# Altium schematic sheet 4. Buck Boost_12V.SchDoc
size A4; SheetNumber: 4; SheetTotal: 6
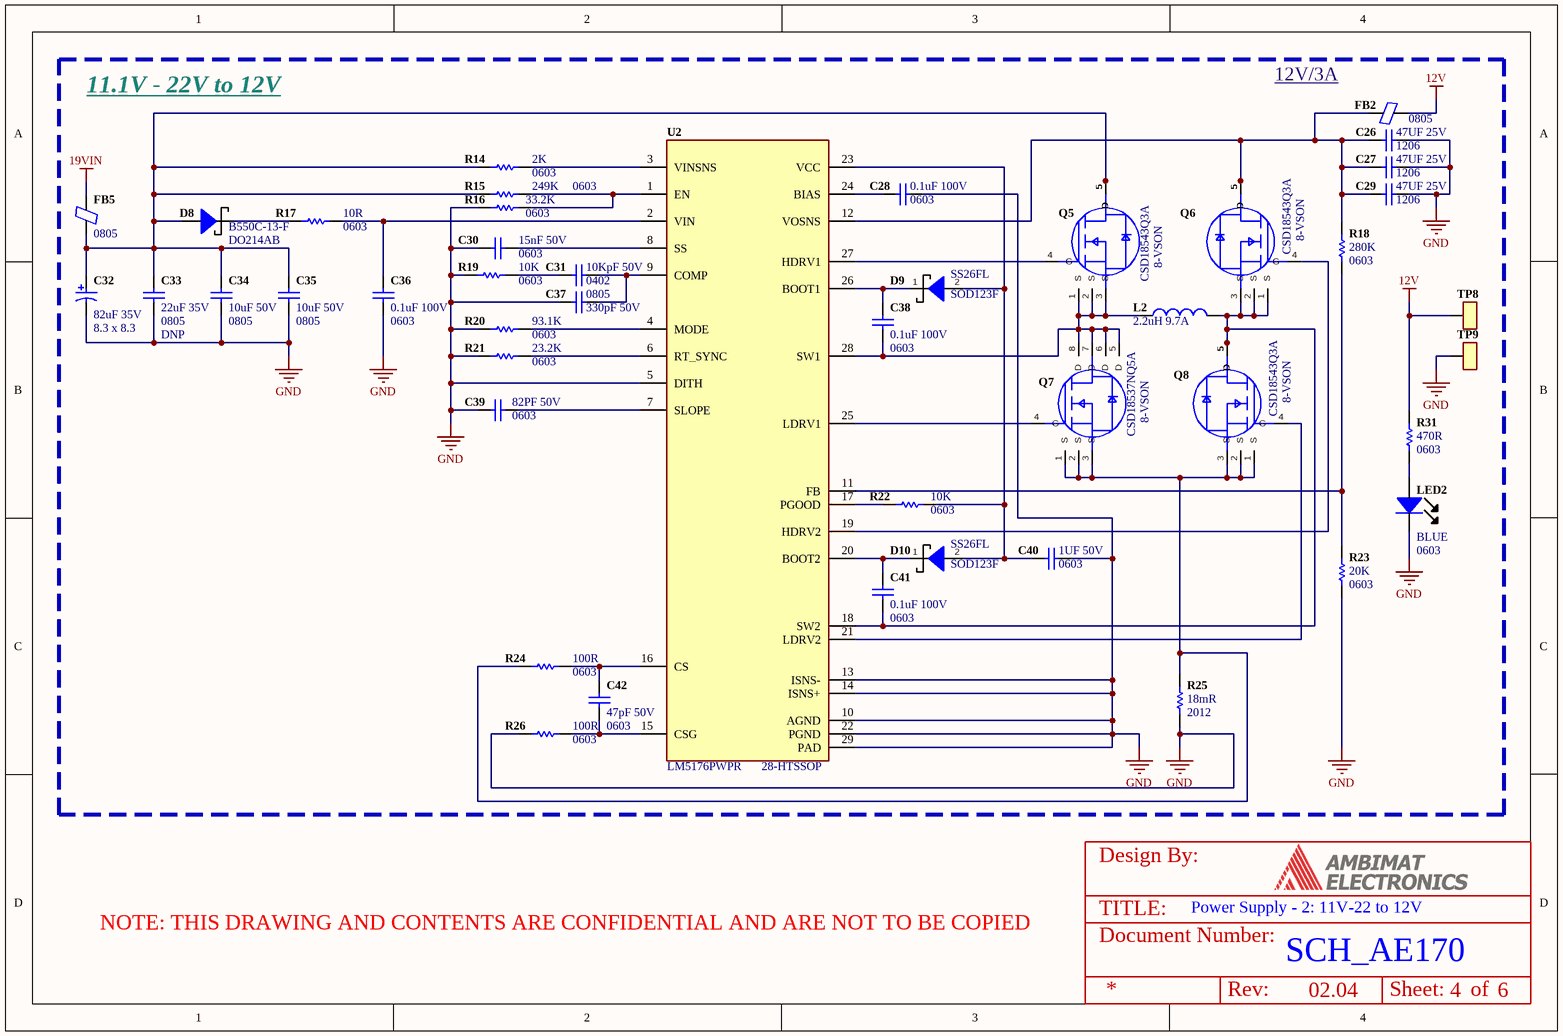
[diagram p0: 4. Buck Boost_12V.SchDoc]

## Parts
C26  Part Name: 47UF 25V  PCB Footprint: 1206  [1206 - NP]  (hidden comment: CAP CER 47UF 25V X5R 1206)
C27  Part Name: 47UF 25V  PCB Footprint: 1206  [1206 - NP]  (hidden comment: CAP CER 47UF 25V X5R 1206)
C28  Part Name: 0.1uF 100V  PCB Footprint: 0603  [0603C]  (hidden comment: CAP CER 0.1UF 100V X7R 0603)
C29  Part Name: 47UF 25V  PCB Footprint: 1206  [1206 - NP]  (hidden comment: CAP CER 47UF 25V X5R 1206)
C30  Part Name: 15nF 50V  PCB Footprint: 0603  [0603C]  (hidden comment: CAP CER 0.015UF 50V X7R 0603)
C31  Part Name: 10KpF 50V  PCB Footprint: 0402  [0402C]  (hidden comment: CAP CER 10000PF 50V X7R 0402)
C32  Part Name: 82uF 35V  PCB Footprint: 8.3 x 8.3  [CAP_PC_8X12_NCH]  (hidden comment: CAP ALUM POLY 82UF 20% 35V SMD)
C33  Mounting: DNP  Part Name: 22uF 35V  PCB Footprint: 0805  [0805C]  (hidden comment: CAP CER 22UF 35V X5R 0805)
C34  Part Name: 10uF 50V  PCB Footprint: 0805  [0805C]  (hidden comment: CAP CER 10UF 50V X5R 0805)
C35  Part Name: 10uF 50V  PCB Footprint: 0805  [0805C]  (hidden comment: CAP CER 10UF 50V X5R 0805)
C36  Part Name: 0.1uF 100V  PCB Footprint: 0603  [0603C]  (hidden comment: CAP CER 0.1UF 100V X7R 0603)
C37  Part Name: 330pF 50V  PCB Footprint: 0805  [0805C]  (hidden comment: CAP CER 330PF 50V C0G/NPO 0805)
C38  Part Name: 0.1uF 100V  PCB Footprint: 0603  [0603C]  (hidden comment: CAP CER 0.1UF 100V X7R 0603)
C39  Part Name: 82PF 50V  PCB Footprint: 0603  [0603C]  (hidden comment: CAP CER 82PF 50V C0G/NPO 0603)
C40  Part Name: 1UF 50V  PCB Footprint: 0603  [0603C]  (hidden comment: CAP CER 1UF 50V X7R 0603)
C41  Part Name: 0.1uF 100V  PCB Footprint: 0603  [0603C]  (hidden comment: CAP CER 0.1UF 100V X7R 0603)
C42  Part Name: 47pF 50V  PCB Footprint: 0603  [0603C]  (hidden comment: CAP CER 47PF 50V X7R 10% 0603)
D8  PCB Footprint: DO214AB  Part Name: B550C-13-F  [DO-214AB-SHKY]  (hidden comment: DIODE SCHOTTKY 50V 5A SMC)
D9  PCB Footprint: SOD123F  Part Name: SS26FL  [SOD123F-SHKY]  (hidden comment: DIODE SCHOTTKY 60V 2A SOD123F)
D10  PCB Footprint: SOD123F  Part Name: SS26FL  [SOD123F-SHKY]  (hidden comment: DIODE SCHOTTKY 60V 2A SOD123F)
FB2  PCB Footprint: 0805  [0805F]  (hidden comment: FERRITE BEAD 120 OHM 0805 1LN)
FB5  PCB Footprint: 0805  [0805F]  (hidden comment: FERRITE BEAD 120 OHM 0805 1LN)
L2  Part Name: 2.2uH 9.7A  [IND_BOURNS_SRP5030]  (hidden comment: FIXED IND 2.2UH 9.7A 14.5MOHM SM)
LED2  PCB Footprint: 0603  Color: BLUE  [LED0603_BLUE]  (hidden comment: LB Q39G-L2N2-35-1)
Q5  PCB Footprint: 8-VSON  Part Name: CSD18543Q3A  [SON65P300X350X90-9N]  (hidden comment: MOSFET N-CH 60V 60A 8VSON)
Q6  PCB Footprint: 8-VSON  Part Name: CSD18543Q3A  [SON65P300X350X90-9N]  (hidden comment: MOSFET N-CH 60V 60A 8VSON)
Q7  PCB Footprint: 8-VSON  Part Name: CSD18537NQ5A  [SON127P500X600]  (hidden comment: MOSFET N-CH 60V 50A 8VSON)
Q8  PCB Footprint: 8-VSON  Part Name: CSD18543Q3A  [SON65P300X350X90-9N]  (hidden comment: MOSFET N-CH 60V 60A 8VSON)
R14  Part Name: 2K  [0603]  (hidden comment: RS2K-0.1W0603)
R15  Part Name: 249K  [0603]  (hidden comment: RES SMD 249K OHM 1% 1/10W 0603)
R16  Part Name: 33.2K  [0603]  (hidden comment: RES SMD 33.2K OHM 1% 1/10W 0603)
R17  Part Name: 10R  [0603]  (hidden comment: RES SMD 10 OHM 1% 1/10W 0603)
R18  Part Name: 280K  [0603]  (hidden comment: RES SMD 280K OHM 1% 1/10W 0603)
R19  Part Name: 10K  [0603]  (hidden comment: RES SMD 10K OHM 5% 1/10W 0603)
R20  Part Name: 93.1K  [0603]  (hidden comment: RES 93.1K OHM 1% 1/10W 0603)
R21  Part Name: 23.2K  [0603]  (hidden comment: RES 23.2K OHM 1% 1/10W 0603)
R22  Part Name: 10K  [0603]  (hidden comment: RES SMD 10K OHM 5% 1/10W 0603)
R23  Part Name: 20K  [0603]  (hidden comment: RES SMD 20K OHM 5% 1/10W 0603)
R24  Part Name: 100R  [0603]  (hidden comment: RES SMD 100 OHM 1% 1/10W 0603)
R25  Part Name: 18mR  PCB Footprint: 2012  [1206_W]  (hidden comment: RES 0.018 OHM 1W 1206 WIDE)
R26  Part Name: 100R  [0603]  (hidden comment: RES SMD 100 OHM 1% 1/10W 0603)
R31  Part Name: 470R  [0603]  (hidden comment: RES 470 OHM 1/10W 5% 0603 SMD)
TP8  TEST POINT  [TP-1.5mmSMD]  (value not drawn)
TP9  TEST POINT  [TP-1.5mmSMD]  (value not drawn)
U2  PCB Footprint: 28-HTSSOP  [HSSOP-28]  (hidden comment: LM5176PWPR)

## Nets
12V: FB2.2 R31.2 TP8.1
19VIN: FB5.1
GND: C26.2 C27.2 C28.2 C29.2 C30.1 C32.2 C33.2 C34.2 C35.2 C36.2 C37.1 C39.1 C40.2 LED2.2(K) R16.1 R19.1 R20.1 R21.1 R23.1 R25.1 R26.1 TP9.1 U2.5(DITH) U2.10(AGND) U2.13(ISNS-) U2.14(ISNS+) U2.22(PGND) U2.29(PAD)
NetC26_1: C26.1 C27.1 C29.1 FB2.1 Q6.5(D) R18.2 U2.12(VOSNS)
NetC28_1: C28.1 U2.24(BIAS)
NetC30_2: C30.2 U2.8(SS)
NetC31_1: C31.1 R19.2
NetC31_2: C31.2 C37.2 U2.9(COMP)
NetC32_1: C32.1 C33.1 C34.1 C35.1 D8.2 FB5.2 Q5.5(D) R14.1 R15.1
NetC36_1: C36.1 R17.2 U2.2(VIN)
NetC38_1: C38.1 L2.1 Q5.1(S) Q5.2(S) Q5.3(S) Q7.5(D) Q7.6(D) Q7.7(D) Q7.8(D) U2.28(SW1)
NetC38_2: C38.2 D9.1 U2.26(BOOT1)
NetC39_2: C39.2 U2.7(SLOPE)
NetC40_1: C40.1 D9.2 D10.2 R22.2 U2.23(VCC)
NetC41_1: C41.1 L2.2 Q6.1(S) Q6.2(S) Q6.3(S) Q8.5(D) U2.18(SW2)
NetC41_2: C41.2 D10.1 U2.20(BOOT2)
NetC42_1: C42.1 R24.2 U2.16(CS)
NetC42_2: C42.2 R26.2 U2.15(CSG)
NetD8_1: D8.1 R17.1
NetLED2_1: LED2.1(A) R31.1
NetQ5_4: Q5.4(G) U2.27(HDRV1)
NetQ6_4: Q6.4(G) U2.19(HDRV2)
NetQ7_1: Q7.1(S) Q7.2(S) Q7.3(S) Q8.1(S) Q8.2(S) Q8.3(S) R24.1 R25.2
NetQ7_4: Q7.4(G) U2.25(LDRV1)
NetQ8_4: Q8.4(G) U2.21(LDRV2)
NetR14_2: R14.2 U2.3(VINSNS)
NetR15_2: R15.2 R16.2 U2.1(EN)
NetR18_1: R18.1 R23.2 U2.11(FB)
NetR20_2: R20.2 U2.4(MODE)
NetR21_2: R21.2 U2.6(RT_SYNC)
NetR22_1: R22.1 U2.17(PGOOD)

## Notes on the sheet
- 11.1V - 22V to 12V
- 12V/3A
- Power Supply - 2: 11V-22 to 12V
- SCH_AE170
- 02.04
- TITLE:
- Design By:
- NOTE: THIS DRAWING AND CONTENTS ARE CONFIDENTIAL AND ARE NOT TO BE COPIED
- Document Number:
- Rev:
- Sheet:
- of

## Library data of the parts
C26 C27 C29 = CS47UF-25V1206: Manufacturer Part Number: C3216X5R1E476M160AC; Manufacturer: TDK Corporation; Vendor-1 Part Number: 445-8047-1-ND; Type: SMD; Vendor-1: DIGIKEY; Vendor-2: FARNELL; Lead Free: YES; Mounting: YES; RoHS Compliant: YES
C28 C36 C38 C41 = CS0.1uF-100V0603: Manu Part Number: CC0603KRX7R0BB104; Manufacturer: YAGEO; Vendor-1 Part Number: 311-1523-1-ND; Type: SMD; Vendor-1: DIGIKEY; Vendor-2: MOUSER; Lead Free: YES; Mounting: YES; RoHS Compliant: YES
C30 = CS15nF-50V0603: Manufacturer Part Number: CL10B153KB8NNNC; Manufacturer: Samsung Electro-Mechanics; Vendor-1 Part Number: 1276-1277-1-ND; Type: SMD; Vendor-1: DIGIKEY; Vendor-2: FARNELL; Lead Free: YES; Mounting: YES; RoHS Compliant: YES
C31 = CS10000pF-50V0402: Manufacturer: TDK Corporation; Vendor-1 Part Number: 445-6893-1-ND; Manufacturer Part Number: CGA2B3X7R1H103K050BB; Type: SMD; Vendor-1: DIGIKEY; Vendor-2: FARNELL; Lead Free: YES; Mounting: YES; RoHS Compliant: YES
C32 = CS82uF-35VALUM: Manu Part Number: 35SVPF82M; Manufacturer: Panasonic; Vendor-1 Part Number: P16562CT-ND; Vendor-1: DIGIKEY; Vendor-2: FARNELL; Help URL: *; Lead Free: YES; Mounting: YES; RoHS Compliant: YES; Type: SMD
C33 = CS22uF-35V0805: Manu Part Number: C2012X5R1V226M125AC; Manufacturer: TDK Corporation; Vendor-1 Part Number: 445-14428-1-ND; Type: SMD; Vendor-1: DIGIKEY; Vendor-2: FARNELL; Help URL: *; Lead Free: YES; RoHS Compliant: YES
C34 C35 = CS10uF-50V0805: Manu Part Number: GRM21BR61H106KE43L; Manufacturer: Murata Electronics; Vendor-1 Part Number: 490-18663-1-ND; Type: SMD; Vendor-1: DIGIKEY; Vendor-2: FARNELL; Help URL: *; Lead Free: YES; Mounting: YES; RoHS Compliant: YES
C37 = CS330pF-50V0805: Manufacturer: YAGEO; Vendor-1 Part Number: 311-1117-1-ND; Manufacturer Part Number: CC0805JRNPO9BN331; Type: SMD; Vendor-1: DIgikey; Vendor-2: Element14; Lead Free: YES; Mounting: YES; Rohs Complinat: YES
C39 = CS82pF-50V0603: Manufacturer: Yageo; Vendor-1 Part Number: 311-1068-1-ND; Manu Part Number: CC0603JRNPO9BN820; Type: SMD; Vendor-1: DIGIKEY; Vendor-2: FARNELL; Lead Free: YES; Mounting: YES; RoHS Compliant: YES
C40 = CS1uF-50V0603: Manu Part Number: CC0603KRX7R9BB105; Manufacturer: Yageo; Vendor-1 Part Number: 311-2082-1-ND; Type: SMD; Vendor-1: DIGIKEY; Vendor-2: FARNELL; Help URL: *; Lead Free: YES; Mounting: YES; RoHS Compliant: YES
C42 = CS47pF-50V0603: Manufacturer: KEMET; Vendor-1 Part Number: 399-16402-1-ND; Manufacturer Part Number: C0603C470K5RAC7867; Type: SMD; Vendor-1: DIGIKEY; Vendor-2: FARNELL; Lead Free: YES; Mounting: YES; RoHS Compliant: YES
D8 = DS-B550C-13-F: Manufacturer: Diodes Incorporated; Vendor-1 Part Number: B550C-FDICT-ND; Type: SMD; Vendor-1: DIGI-KEY; Vendor-2: MOUSER; Help URL: *; Lead Free: YES; Mounting: YES; Manu Part Number: B550C-13-F
D9 D10 = DS-SS26FL: Manufacturer: onsemi; Vendor-1 Part Number: SS26FLCT-ND; Type: SMD; Vendor-1: DIGI-KEY; Vendor-2: MOUSER; Help URL: *; Lead Free: YES; Mounting: YES; Manu Part Number: SS26FL
FB2 FB5 = FB120OHM-0805: Manufacturer: Pulse Electronics; Manufacturer Part Number: ABUP00201209121Y00; Vendor-1 Part Number: 553-ABUP00201209121Y00CT-ND; Vendor-1: Digikey; Type: SMD; Lead Free: YES; RoHS Compliant: YES; Vendor-2 Part Number: *; Vendor-2: *; Mounting: YES; Part Name: ABUP00201209121Y00
L2 = LS2.2uH9.7A-5553: Manufacturer Part Number: SRP5030CA-2R2M; Manufacturer: Bourns Inc.; Vendor-1 Part Number: SRP5030CA-2R2MCT-ND; Type: SMD; Vendor-1: Digikey; PCB Footprint: 5553; Lead Free: YES; RoHS Compliant: YES; Vendor-2 Part Number: *; Vendor-2: *; Mounting: YES
LED2 = LED-BLUE0603: LED BLUE CLEAR 3MM 470NM; Manufacturer: OSRAM Opto Semiconductors Inc; Vendor-1 Part Number: 475-2816-1-ND; Vendor-2 Part Number: 1652110; Type: SMD; Vendor-1: DIGIKEY; Vendor-2: FARNELL; Help URL: *; Lead Free: YES; Manu Part Number: LB Q39G-L2N2-35-1; Mounting: YES; RoHS Compliant: YES; Part Name: LB Q39G-L2N2-35-1
Q5 Q6 Q8 = MS-CSD18543Q3A: Manufacturer: Texas Instruments; Vendor-1 Part Number: 296-47321-1-ND; Type: TH; Vendor-1: DIGIKEY; Lead Free: YES; Manu Part Number: CSD18543Q3A; Mounting: YES; RoHS Compliant: YES
Q7 = MS-CSD18537NQ5A: Manufacturer: Texas Instruments; Vendor-1 Part Number: 296-36455-1-ND; Type: TH; Vendor-1: DIGIKEY; Lead Free: YES; Manu Part Number: CSD18537NQ5A; Mounting: YES; RoHS Compliant: YES
R14 = RS2K-0.1W0603: RES SMD 2K OHM 5% 1/10W 0603; Manu Part Number: ERJ-3GEYJ202V; Manufacturer: Panasonic; Vendor-1 Part Number: P2.0KGCT-ND; Vendor-1: DIGIKEY; Vendor-2: FARNELL; Lead Free: YES; Mounting: YES; RoHS Compliant: YES; Type: SMD; PCB Footprint: 0603
R15 = RS249K-0.1W0603: Manufacturer Part Number: AC0603FR-07249KL; Manufacturer: Yageo; Vendor-1 Part Number: 13-AC0603FR-07249KLCT-ND; Vendor-1: DIGIKEY; Vendor-2: FARNELL; Lead Free: YES; Mounting: YES; RoHS Compliant: YES; Type: SMD; PCB Footprint: 0603
R16 = RS33.2K-0.1W0603: Manufacturer: Panasonic Electronic Components; Vendor-1 Part Number: P33.2KHCT-ND; Manu Part Number: ERJ-3EKF3322V; Vendor-1: DIGIKEY; Vendor-2: FARNELL; Lead Free: YES; Mounting: YES; RoHS Compliant: YES; Type: SMD; PCB Footprint: 0603
R17 = RS10R-0.1W0603: Manu Part Number: CRCW060310R0FKEA; Manufacturer: Vishay Dale; Vendor-1 Part Number: 541-10.0HCT-ND; Vendor-1: DIGIKEY; Vendor-2: FARNELL; Lead Free: YES; Mounting: YES; RoHS Compliant: YES; Type: SMD; PCB Footprint: 0603
R18 = RS280K-0.1W0603: Manu Part Number: CRCW0603280KFKEA; Manufacturer: Vishay Dale; Vendor-1 Part Number: 541-280KHCT-ND; Vendor-1: DIGIKEY; Vendor-2: FARNELL; Help URL: *; Lead Free: YES; Mounting: YES; RoHS Compliant: YES; Type: SMD; PCB Footprint: 0603
R19 = RS10K-0.1W0603: Manufacturer Part Number: RC0603JR-0710KL; Manufacturer: Yageo; Vendor-1 Part Number: 311-10KGRCT-ND; Vendor-1: DIGIKEY; Vendor-2: FARNELL; Lead Free: YES; Mounting: YES; Help URL: https://www.digikey.com/product-detail/en/yageo/RC0603JR-0710KL/311-10KGRCT-ND/729647; RoHS Compliant: YES; Type: SMD; PCB Footprint: 0603
R20 = RS93.1K-0.1W0603: Manu Part Number: RC0603FR-0793K1L; Manufacturer: YAGEO; Vendor-1 Part Number: 311-93.1KHRCT-ND; Vendor-1: DIGIKEY; Vendor-2: FARNELL; Lead Free: YES; Mounting: YES; RoHS Compliant: YES; Type: SMD; PCB Footprint: 0603
R21 = RS23.2K-0.1W0603: Manu Part Number: RC0603FR-0723K2L; Manufacturer: YAGEO; Vendor-1 Part Number: 311-23.2KHRCT-ND; Vendor-1: DIGIKEY; Vendor-2: FARNELL; Lead Free: YES; Mounting: YES; RoHS Compliant: YES; Type: SMD; PCB Footprint: 0603
R22 = RS10K-0.1W0603: Manufacturer: Yageo; Vendor-1 Part Number: 311-10KGRCT-ND; Manufacturer Part Number: RC0603JR-0710KL; Vendor-1: DIGIKEY; Vendor-2: FARNELL; Lead Free: YES; Mounting: YES; RoHS Compliant: YES; Type: SMD; PCB Footprint: 0603; Help URL: https://www.digikey.com/product-detail/en/yageo/RC0603JR-0710KL/311-10KGRCT-ND/729647
R23 = RS20K-0.1W0603: Manu Part Number: CRCW060320K0JNEA; Manufacturer: Vishay Dale; Vendor-1 Part Number: 541-20KGCT-ND; Vendor-1: DIGIKEY; Vendor-2: FARNELL; Lead Free: YES; Mounting: YES; RoHS Compliant: YES; Type: SMD; Help URL: *; PCB Footprint: 0603
R24 R26 = RS100R-0.1W0603: Manu Part Number: CRCW0603100RFKEA; Manufacturer: Vishay Dale; Vendor-1 Part Number: 541-100HCT-ND; Vendor-1: DIGIKEY; Vendor-2: FARNELL; Lead Free: YES; Mounting: YES; RoHS Compliant: YES; Type: SMD; PCB Footprint: 0603
R25 = RS18mR-1W1206: Manu Part Number: PRL1632-R018-F-T1; Manufacturer: Susumu; Vendor-1 Part Number: PRL1632.018FCT-ND; Vendor-1: DIGIKEY; Vendor-2: FARNELL; Lead Free: YES; Mounting: YES; RoHS Compliant: YES; Type: SMD
R31 = RS470R-1/10W0603: Manu Part Number: RC0603JR-07470RL; Manufacturer: YAGEO; Vendor-1 Part Number: 311-470GRCT-ND; Vendor-1: DIGIKEY; Vendor-2: MOUSER; Lead Free: YES; Mounting: YES; RoHS Compliant: YES; Type: SMD; PCB Footprint: 0603
TP8 TP9 = TP-1.5mmSMD: SMD TEST POINT
U2 = IC28P-LM5176PWPR: Manufacturer: Texas Instruments; Vendor-1 Part Number: 296-49223-1-ND; Vendor-1: DigiKey; Vendor-2: Element14; Lead Free: YES; Mounting: YES; RoHS Compliant: YES; Type: SMD; Manufacturer Part Numbe: LM5176PWPR